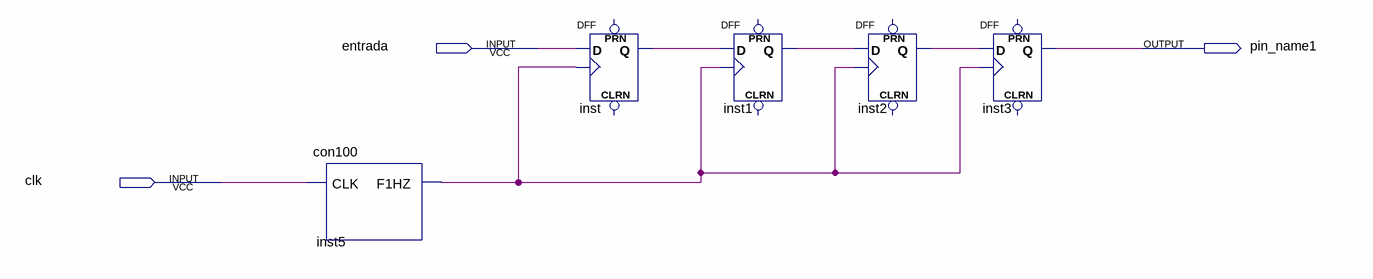
[diagram p0: schematic sheet]
// Quartus schematic siso.bdf as structural Verilog: 5 symbols, 3 pins
module siso (
  input  entrada,
  input  clk,
  output pin_name1
);

  wire inst1_q, inst2_q, inst5_f1hz, inst_q;

  con100 inst5 (.CLK(clk), .F1HZ(inst5_f1hz));
  DFF inst (.CLK(inst5_f1hz), .D(entrada), .Q(inst_q));  // open: CLRN, PRN
  DFF inst1 (.CLK(inst5_f1hz), .D(inst_q), .Q(inst1_q));  // open: CLRN, PRN
  DFF inst2 (.CLK(inst5_f1hz), .D(inst1_q), .Q(inst2_q));  // open: CLRN, PRN
  DFF inst3 (.CLK(inst5_f1hz), .D(inst2_q), .Q(pin_name1));  // open: CLRN, PRN
endmodule
